# EAGLE schematic _nuc029LAN.06092f85-b559-42b7-8752-c31b1aa992a3 (EAGLE 9.7.0)

## Sheet 1 of 7: POWER
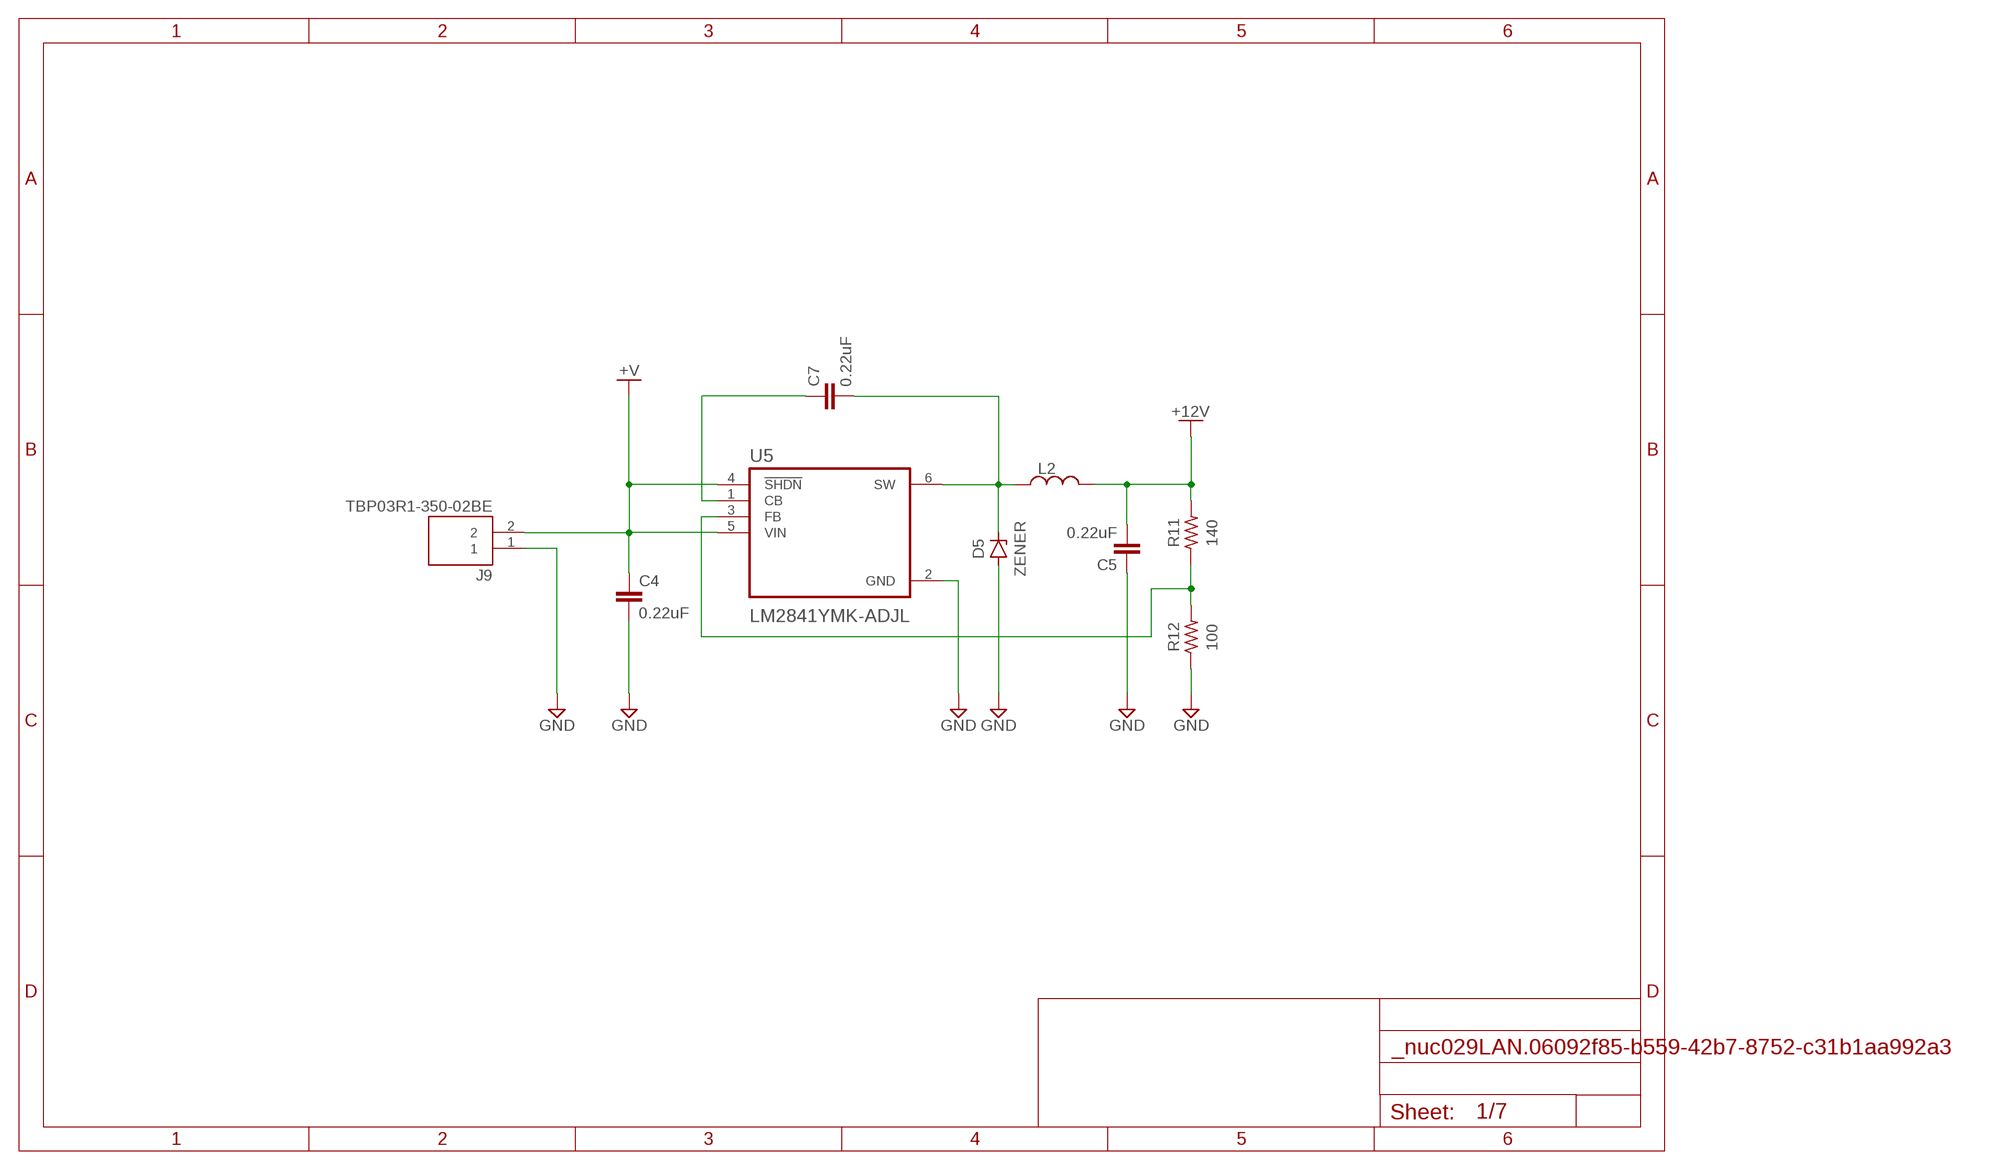
[diagram p0: schematic, sheet 1]

### Parts
C4  0.22uF  0.22UF-0603-50V-10%  [0603]
C5  0.22uF  0.22UF-0603-50V-10%  [0603]
C7  0.22uF  0.22UF-0603-50V-10%  [0603]
D5  ZENER  ZENERDO-214AB(SMC)  [DIOM7959X625N]
J9  TBP03R1-350-02BE  [CUI_TBP03R1-350-02BE]
L2  L_MOLDED(8530-METRIC)  [INDM8530X267]
R11  140  R-US_AXIAL-7.2MM-PITCH  [RESAD724W46L381D178B]
R12  100  R-US_AXIAL-7.2MM-PITCH  [RESAD724W46L381D178B]
U5  LM2841YMK-ADJL  [SOT95P280X110-6N]

### Nets
+12V: C5.2 L2.2 R11.2 ; also sheet 2,7
+V: C4.1 J9.2 U5.4(!SHDN) U5.5(VIN)
GND: C4.2 C5.1 D5.2(A) J9.1 R12.1 U5.2(GND) ; also sheet 2,3,6,7
N$15: C7.2 D5.1(C) L2.1 U5.6(SW)
N$19: C7.1 U5.1(CB)
N$21: R11.1 R12.2 U5.3(FB)

## Sheet 2 of 7
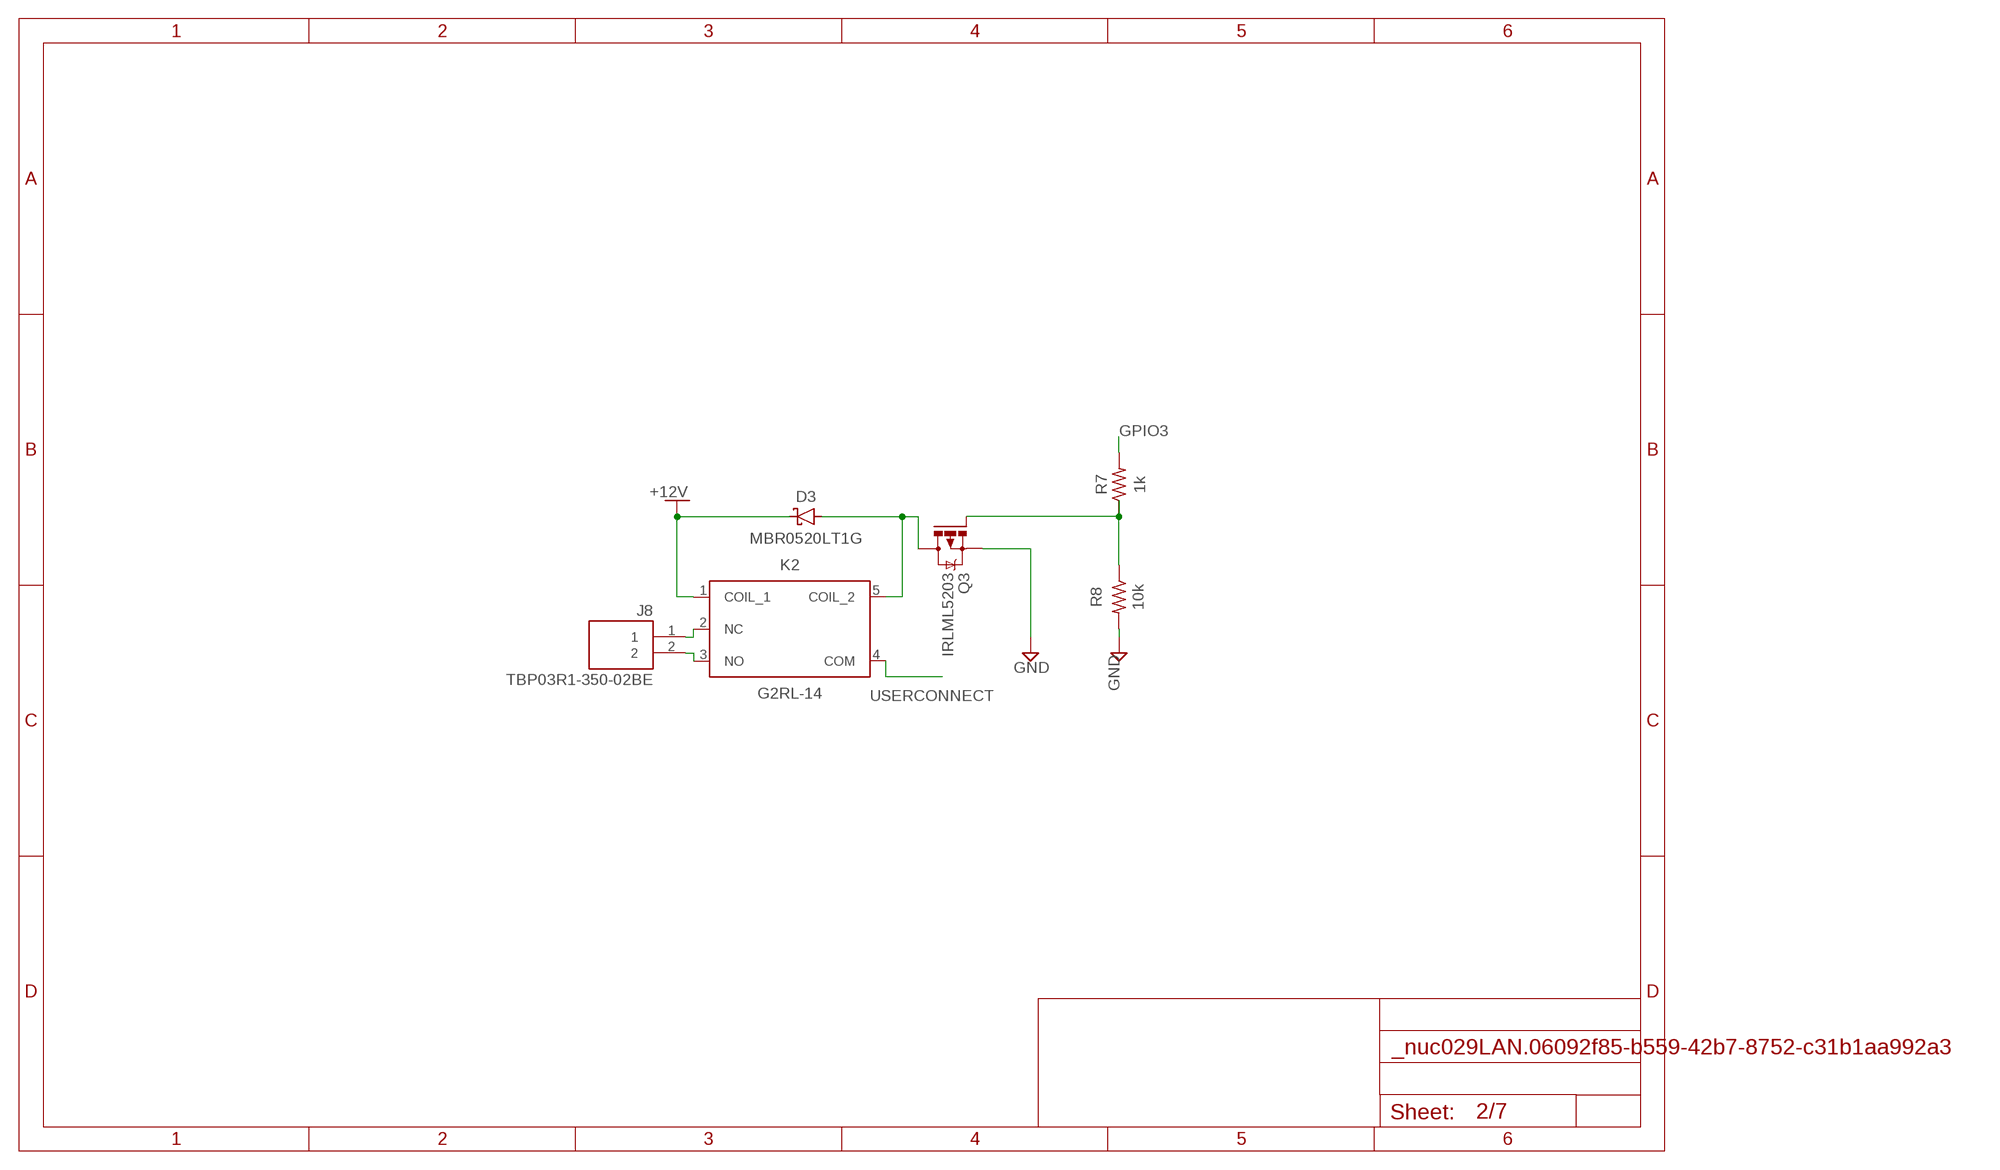
[diagram p1: schematic, sheet 2]

### Parts
D3  MBR0520LT1G  SCHOTTKY_MBR0520LT1GDO-219  [SODFL3718X115]
J8  TBP03R1-350-02BE  [CUI_TBP03R1-350-02BE]
K2  G2RL-14  [G2RL-1]
Q3  IRLML5203  PMOSFET_IRLML5203_SOT23-GSD  [SOT23]
R7  1k  R-US_AXIAL-7.2MM-PITCH  [RESAD724W46L381D178B]
R8  10k  R-US_AXIAL-7.2MM-PITCH  [RESAD724W46L381D178B]

### Nets
+12V: D3.1(C) K2.1(COIL_1) ; also sheet 1,7
GND: J8.1 K2.2(NC) Q3.2(S) R8.2 ; also sheet 1,3,6,7
GPIO3: R7.2 ; also sheet 6,7
N$9: J8.2 K2.3(NO)
N$20: Q3.1(G) R7.1 R8.1
USERCONNECT: K2.4(COM)
VOUT: D3.2(A) K2.5(COIL_2) Q3.3(D) ; also sheet 5,7

## Sheet 3 of 7
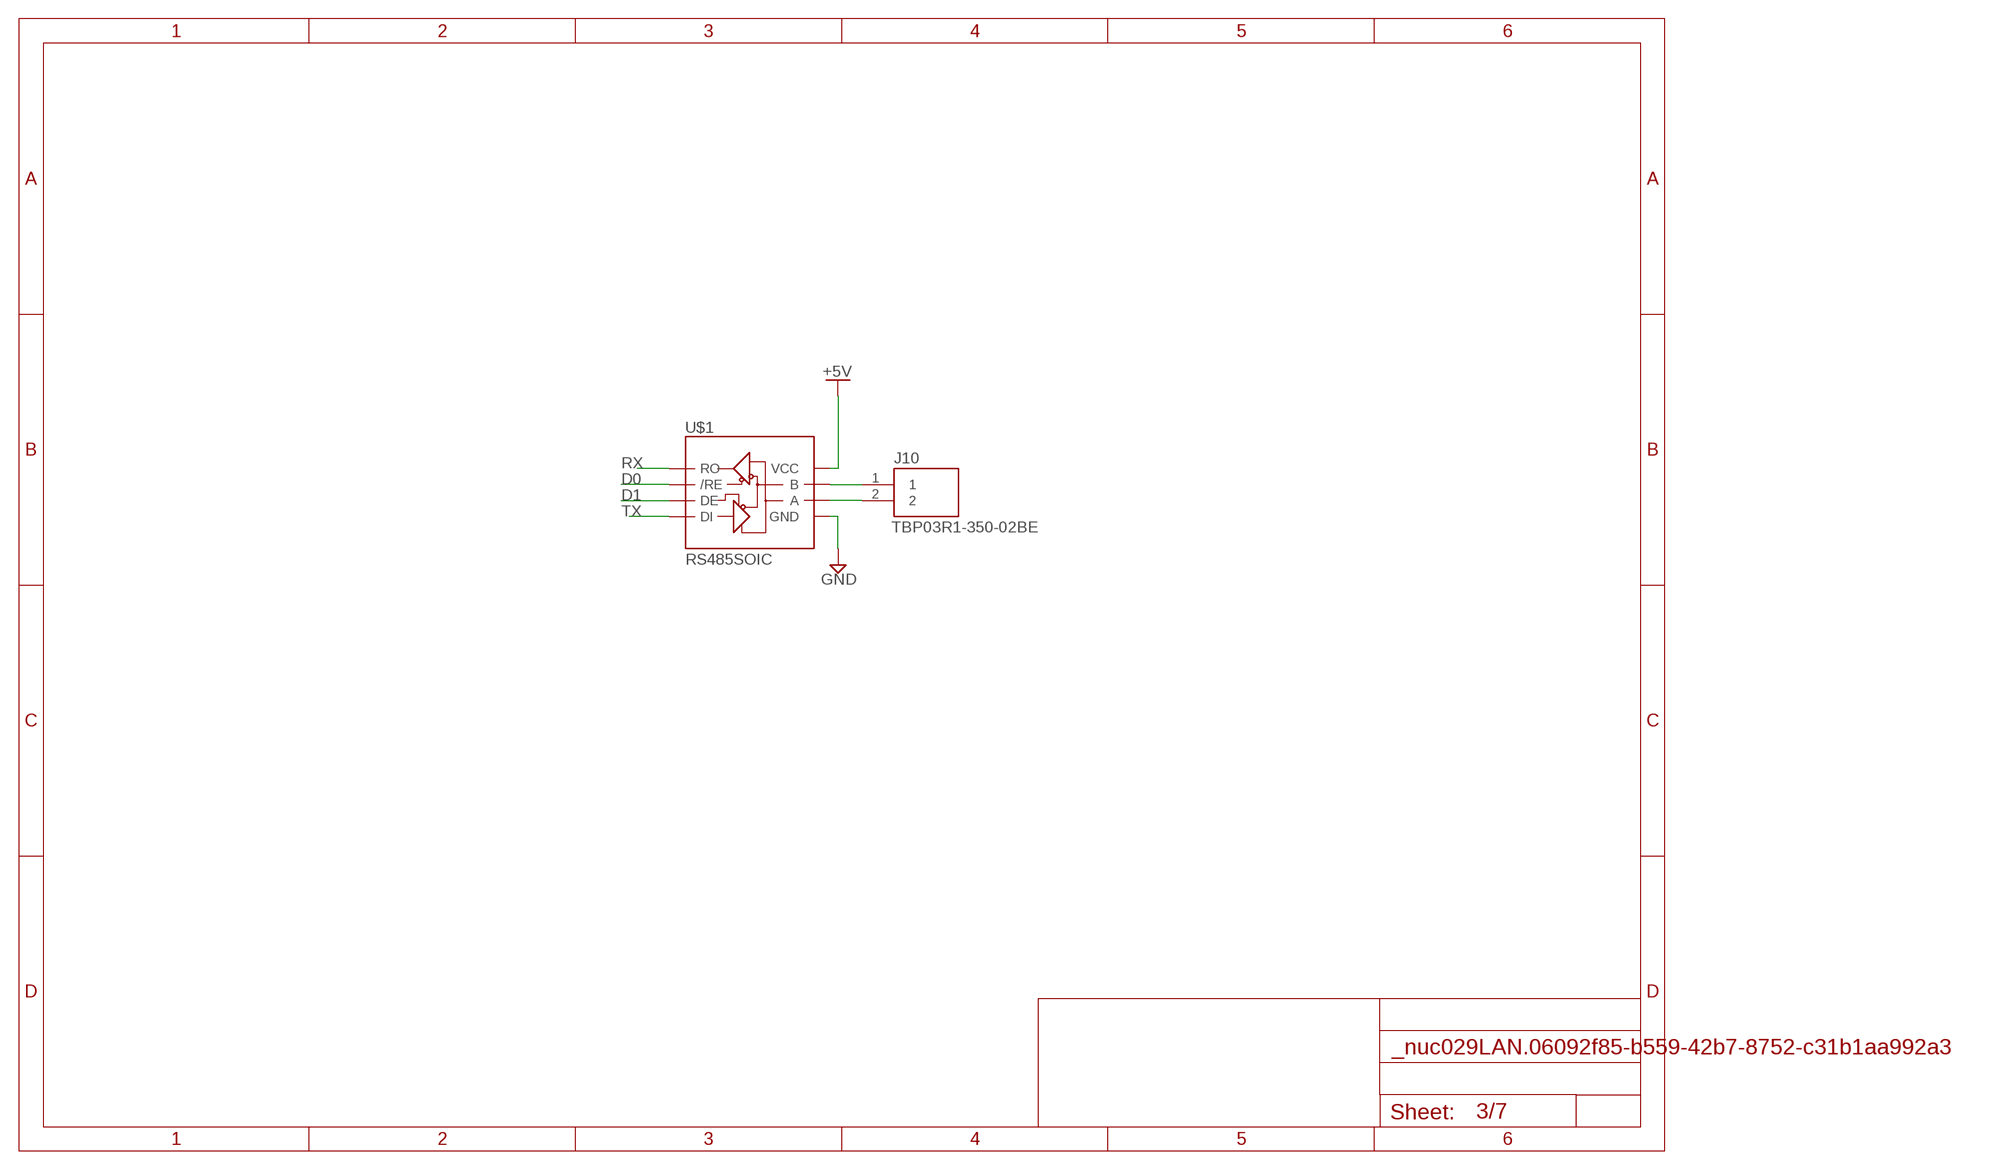
[diagram p2: schematic, sheet 3]

### Parts
J10  TBP03R1-350-02BE  [CUI_TBP03R1-350-02BE]
U$1  RS485SOIC  [SO08]

### Nets
+5V: U$1.8(VCC) ; also sheet 7
D0: U$1.2(/RE) ; also sheet 5,6,7
D1: U$1.3(DE) ; also sheet 5,6,7
GND: U$1.5(GND) ; also sheet 1,2,6,7
N$6: J10.1 U$1.7(B)
N$8: J10.2 U$1.6(A)
RX: U$1.1(RO) ; also sheet 6,7
TX: U$1.4(DI) ; also sheet 6,7

## Sheet 4 of 7
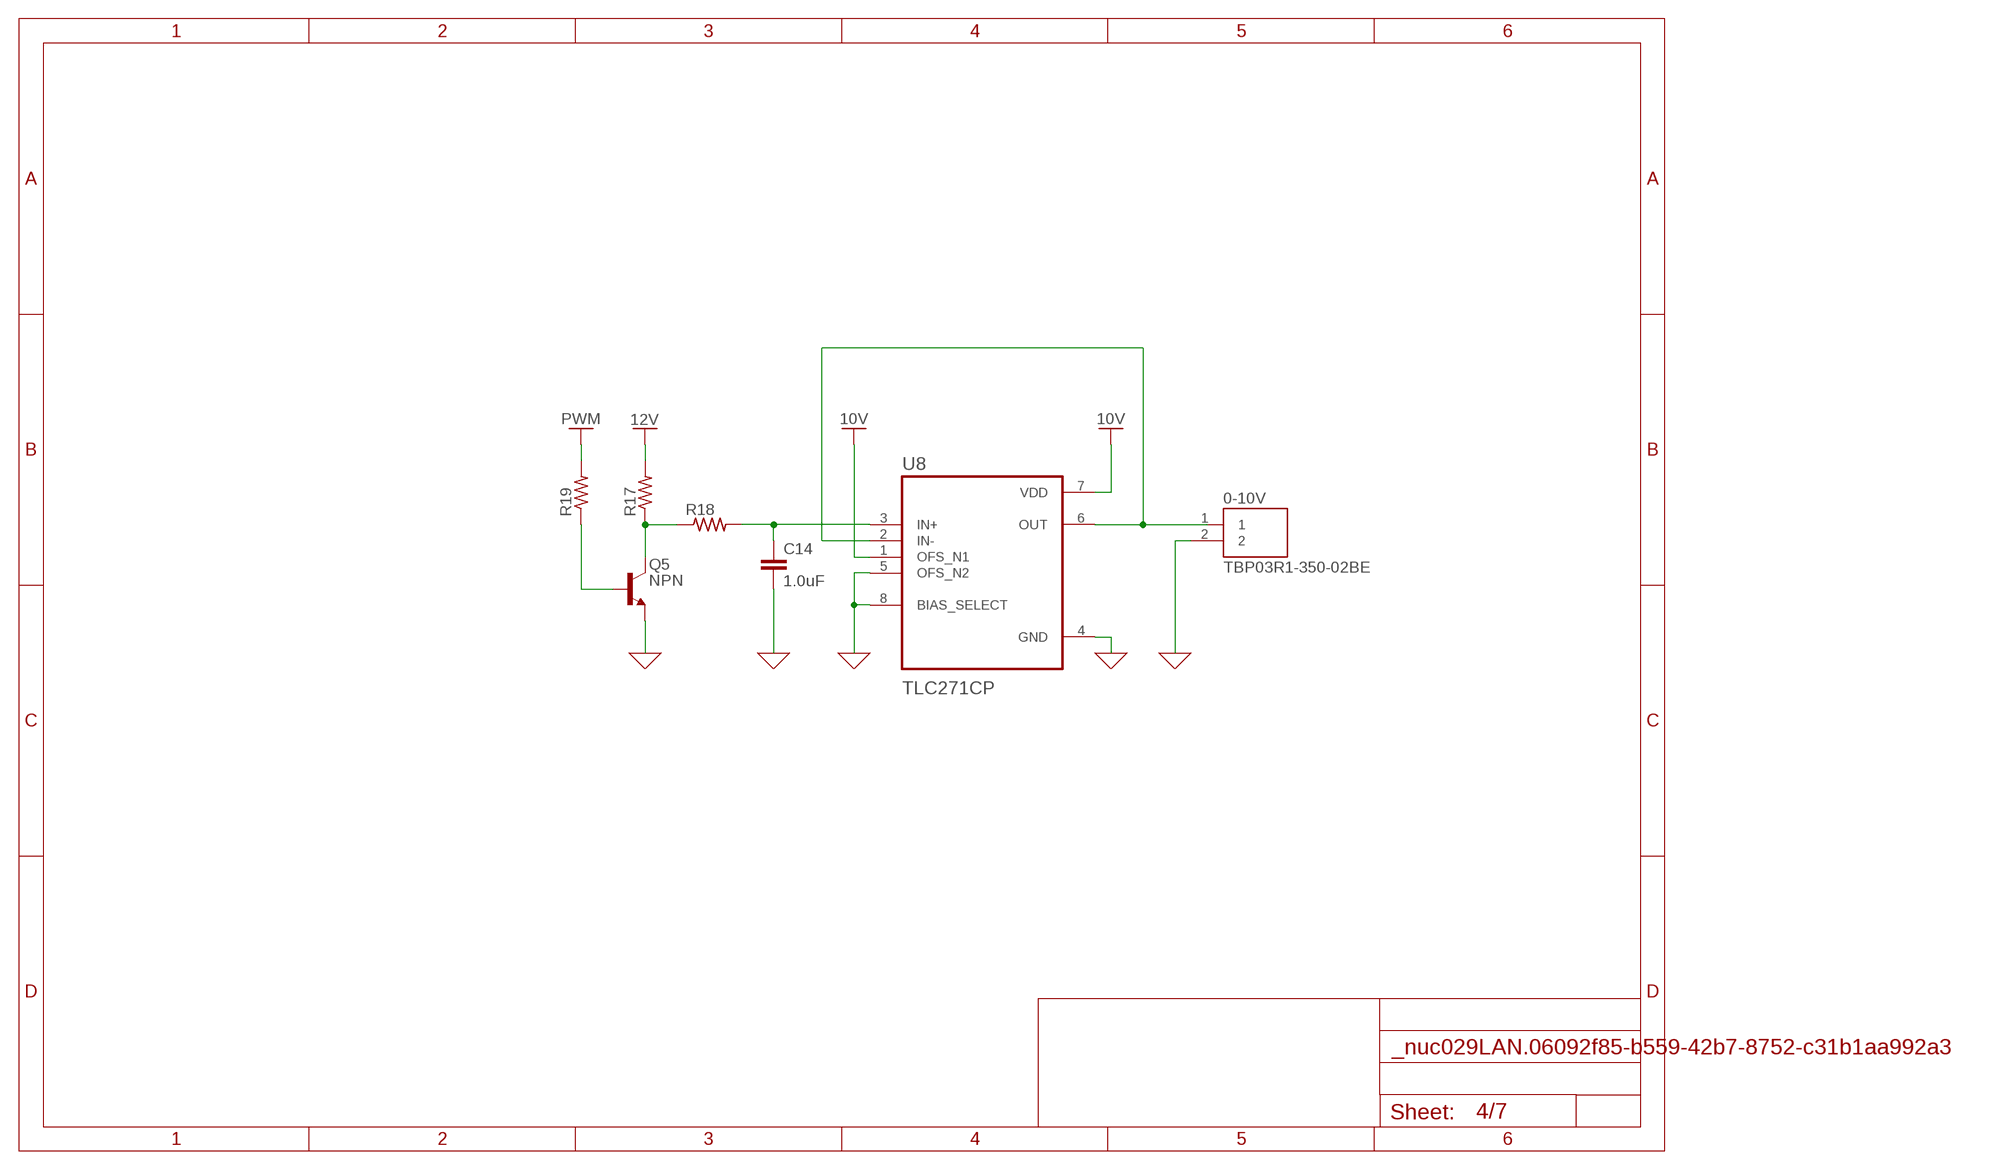
[diagram p3: schematic, sheet 4]

### Parts
0-10V  TBP03R1-350-02BE  [CUI_TBP03R1-350-02BE]
C14  1.0uF  1.0UF-0603-16V-10%-X7R-WE  [0603]
Q5  NPN  NPN_TO18-EBC  [TO18]
R17  R-US_CHIP-1210(3225-METRIC)  [RESC3224X71]
R18  R-US_CHIP-1210(3225-METRIC)  [RESC3224X71]
R19  R-US_CHIP-1210(3225-METRIC)  [RESC3224X71]
U8  TLC271CP  [DIP794W45P254L959H508Q8]

### Nets
0: 0-10V.2 C14.2 Q5.1(E) U8.4(GND) U8.5(OFS_N2) U8.8(BIAS_SELECT) ; supply symbol labelled GND
0-10V: 0-10V.1 U8.2(IN-) U8.6(OUT)
10V: U8.1(OFS_N1) U8.7(VDD) ; also sheet 6,7
12V: R17.2
N$25: Q5.3(C) R17.1 R18.1
N$26: Q5.2(B) R19.1
N$27: C14.1 R18.2 U8.3(IN+)
PWM: R19.2

## Sheet 5 of 7
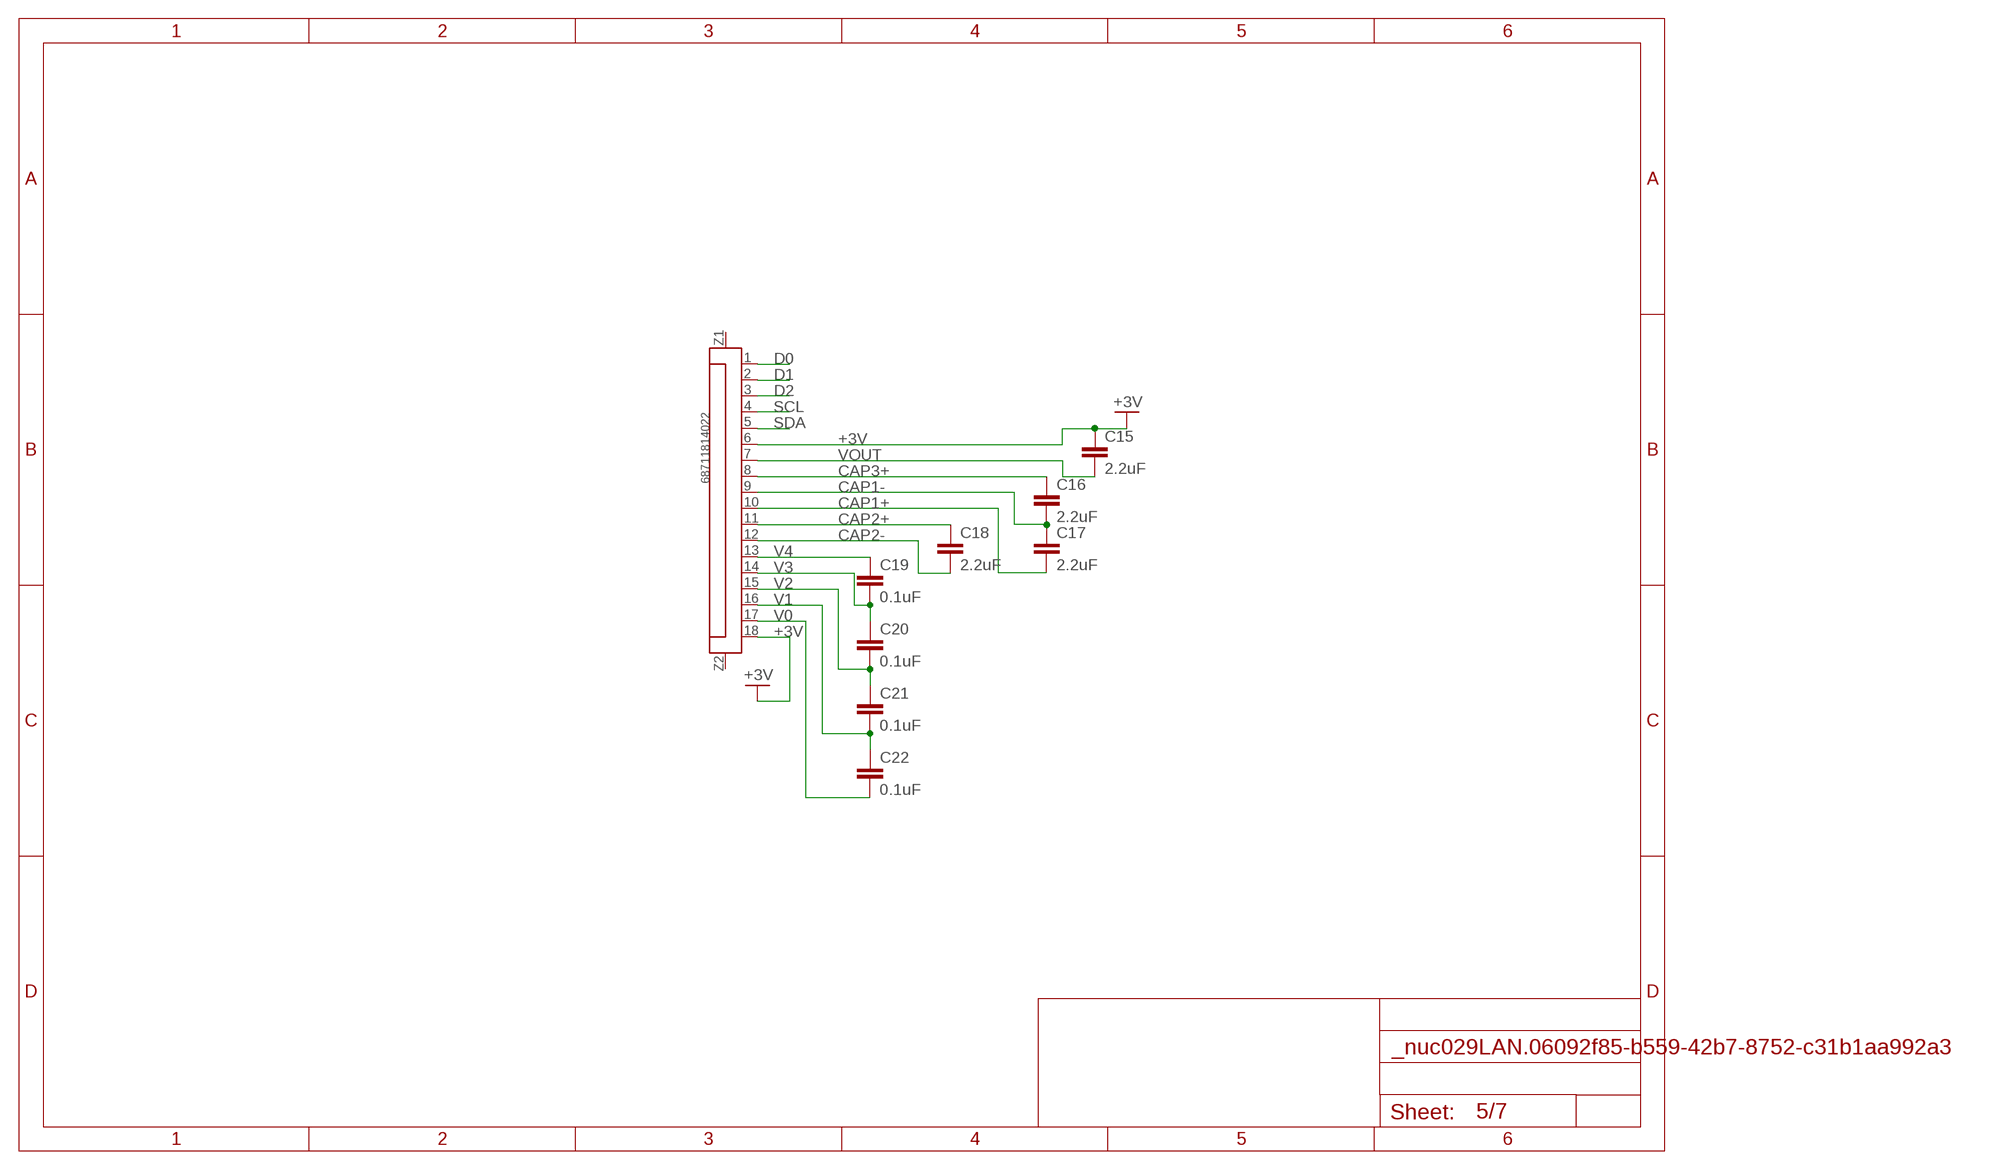
[diagram p4: schematic, sheet 5]

### Parts
/CS1  68711814022  6871XX14022_68711814022  [68711814022]
C15  2.2uF  2.2UF-0402_TIGHT-10V-10%-X5R  [0402-TIGHT]
C16  2.2uF  2.2UF-0402_TIGHT-10V-10%-X5R  [0402-TIGHT]
C17  2.2uF  2.2UF-0402_TIGHT-10V-10%-X5R  [0402-TIGHT]
C18  2.2uF  2.2UF-0402_TIGHT-10V-10%-X5R  [0402-TIGHT]
C19  0.1uF  0.1UF-0603-50V-10%-X7R-WE  [0603]
C20  0.1uF  0.1UF-0603-50V-10%-X7R-WE  [0603]
C21  0.1uF  0.1UF-0603-50V-10%-X7R-WE  [0603]
C22  0.1uF  0.1UF-0603-50V-10%-X7R-WE  [0603]

### Nets
+3V: /CS1.6 /CS1.18 C15.1
CAP1+: /CS1.10 C17.2
CAP1-: /CS1.9 C16.2 C17.1
CAP2+: /CS1.11 C18.1
CAP2-: /CS1.12 C18.2
CAP3+: /CS1.8 C16.1
D0: /CS1.1 ; also sheet 3,6,7
D1: /CS1.2 ; also sheet 3,6,7
D2: /CS1.3 ; also sheet 6,7
SCL: /CS1.4 ; also sheet 6,7
SDA: /CS1.5 ; also sheet 6,7
V0: /CS1.17 C22.2
V1: /CS1.16 C21.2 C22.1
V2: /CS1.15 C20.2 C21.1
V3: /CS1.14 C19.2 C20.1
V4: /CS1.13 C19.1
VOUT: /CS1.7 C15.2 ; also sheet 2,7
Unconnected: /CS1.Z1 /CS1.Z2

## Sheet 6 of 7
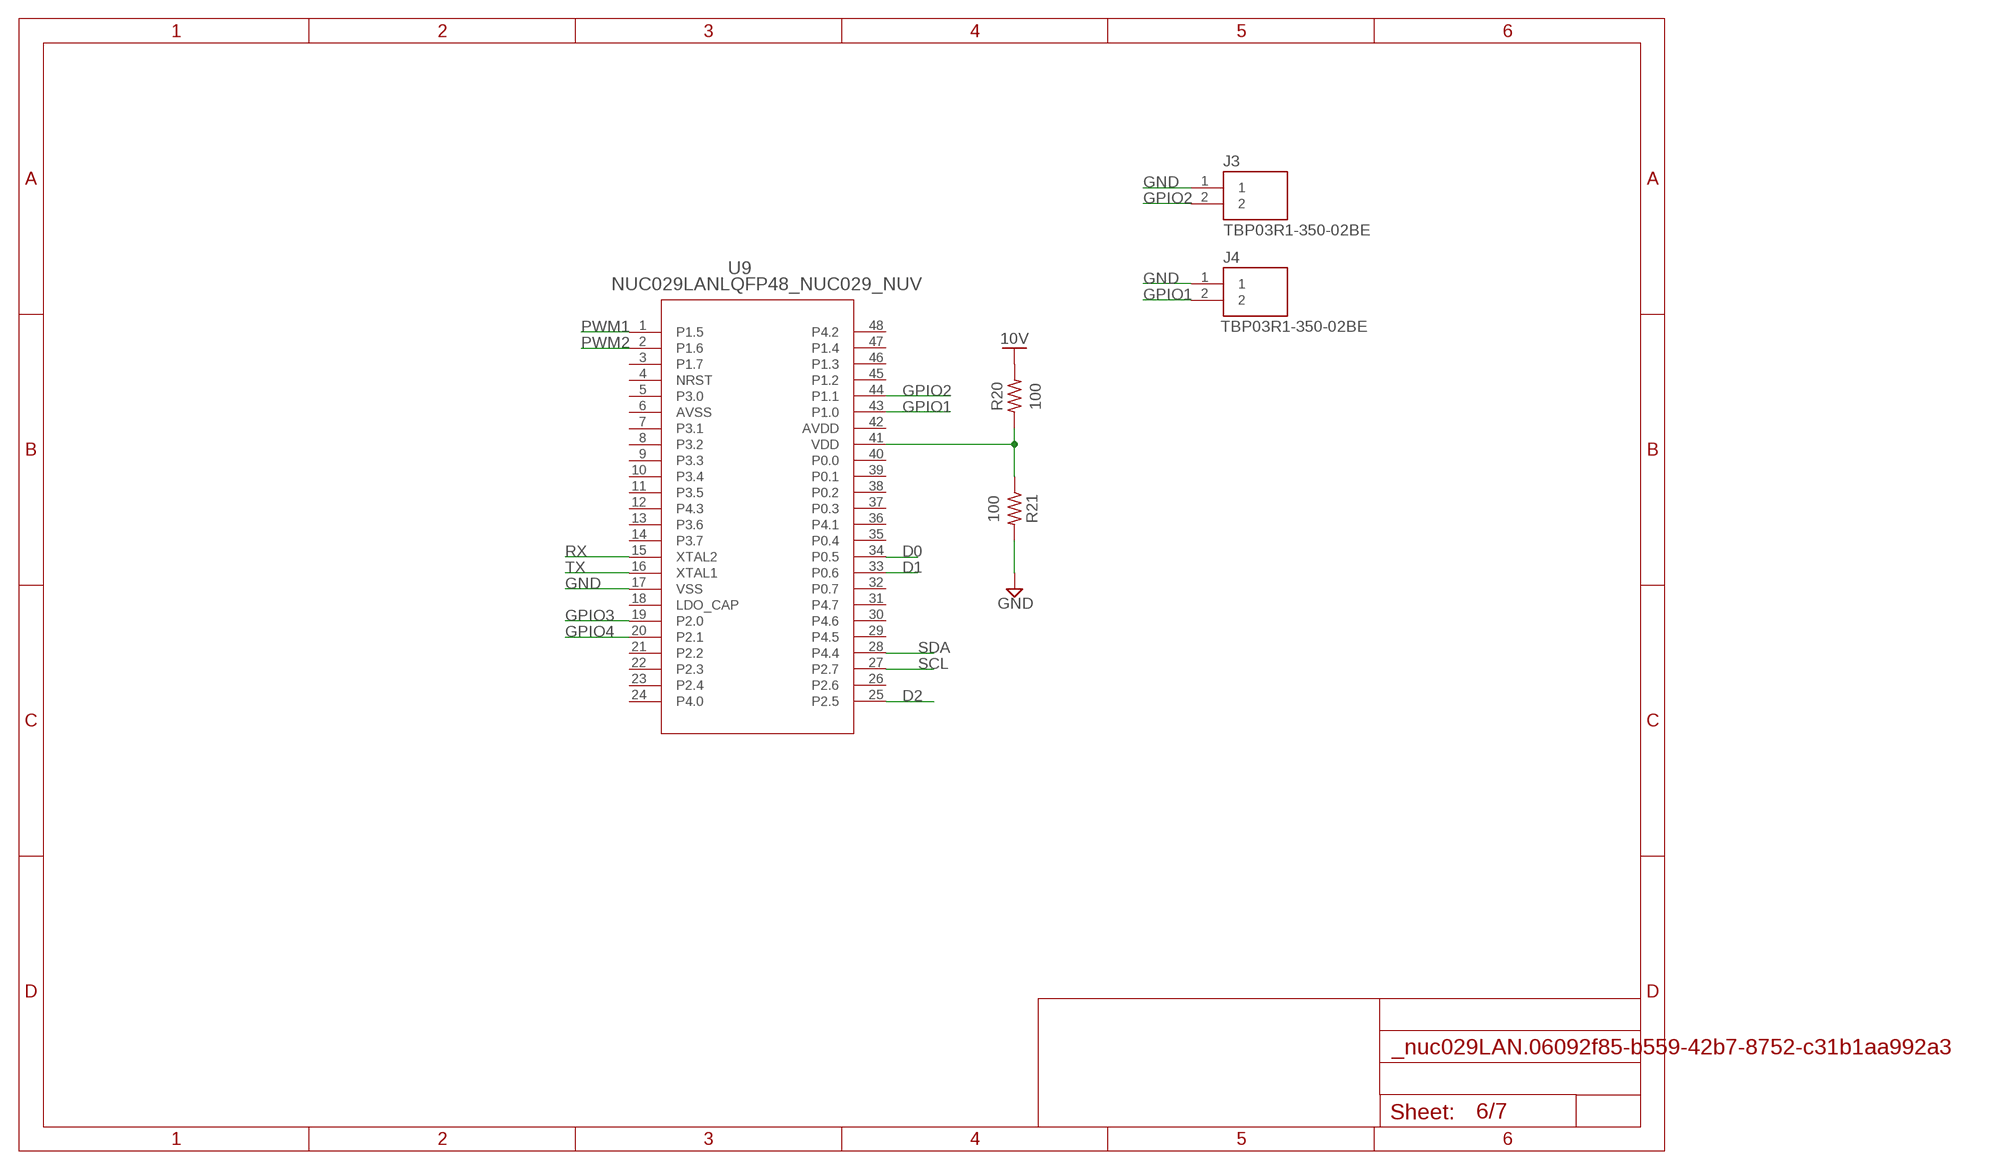
[diagram p5: schematic, sheet 6]

### Parts
J3  TBP03R1-350-02BE  [CUI_TBP03R1-350-02BE]
J4  TBP03R1-350-02BE  [CUI_TBP03R1-350-02BE]
R20  100  R-US_AXIAL-7.2MM-PITCH  [RESAD724W46L381D178B]
R21  100  R-US_AXIAL-7.2MM-PITCH  [RESAD724W46L381D178B]
U9  NUC029LANLQFP48_NUC029_NUV  [LQFP48_NUC029_NUV]

### Nets
10V: R20.2 ; also sheet 4,7
D0: U9.34(P0.5) ; also sheet 3,5,7
D1: U9.33(P0.6) ; also sheet 3,5,7
D2: U9.25(P2.5) ; also sheet 5,7
GND: J3.1 J4.1 R21.2 U9.17(VSS) ; also sheet 1,2,3,7
GPIO1: J4.2 U9.43(P1.0) ; also sheet 7
GPIO2: J3.2 U9.44(P1.1) ; also sheet 7
GPIO3: U9.19(P2.0) ; also sheet 2,7
GPIO4: U9.20(P2.1) ; also sheet 7
N$16: R20.1 R21.1 U9.41(VDD)
PWM1: U9.1(P1.5) ; also sheet 7
PWM2: U9.2(P1.6) ; also sheet 7
RX: U9.15(XTAL2) ; also sheet 3,7
SCL: U9.27(P2.7) ; also sheet 5,7
SDA: U9.28(P4.4) ; also sheet 5,7
TX: U9.16(XTAL1) ; also sheet 3,7
Unconnected: U9.3(P1.7) U9.4(NRST) U9.5(P3.0) U9.6(AVSS) U9.7(P3.1) U9.8(P3.2) U9.9(P3.3) U9.10(P3.4) U9.11(P3.5) U9.12(P4.3) U9.13(P3.6) U9.14(P3.7) U9.18(LDO_CAP) U9.21(P2.2) U9.22(P2.3) U9.23(P2.4) U9.24(P4.0) U9.26(P2.6) U9.29(P4.5) U9.30(P4.6) U9.31(P4.7) U9.32(P0.7) U9.35(P0.4) U9.36(P4.1) U9.37(P0.3) U9.38(P0.2) U9.39(P0.1) U9.40(P0.0) U9.45(P1.2) U9.46(P1.3) U9.47(P1.4) U9.48(P4.2)

## Sheet 7 of 7
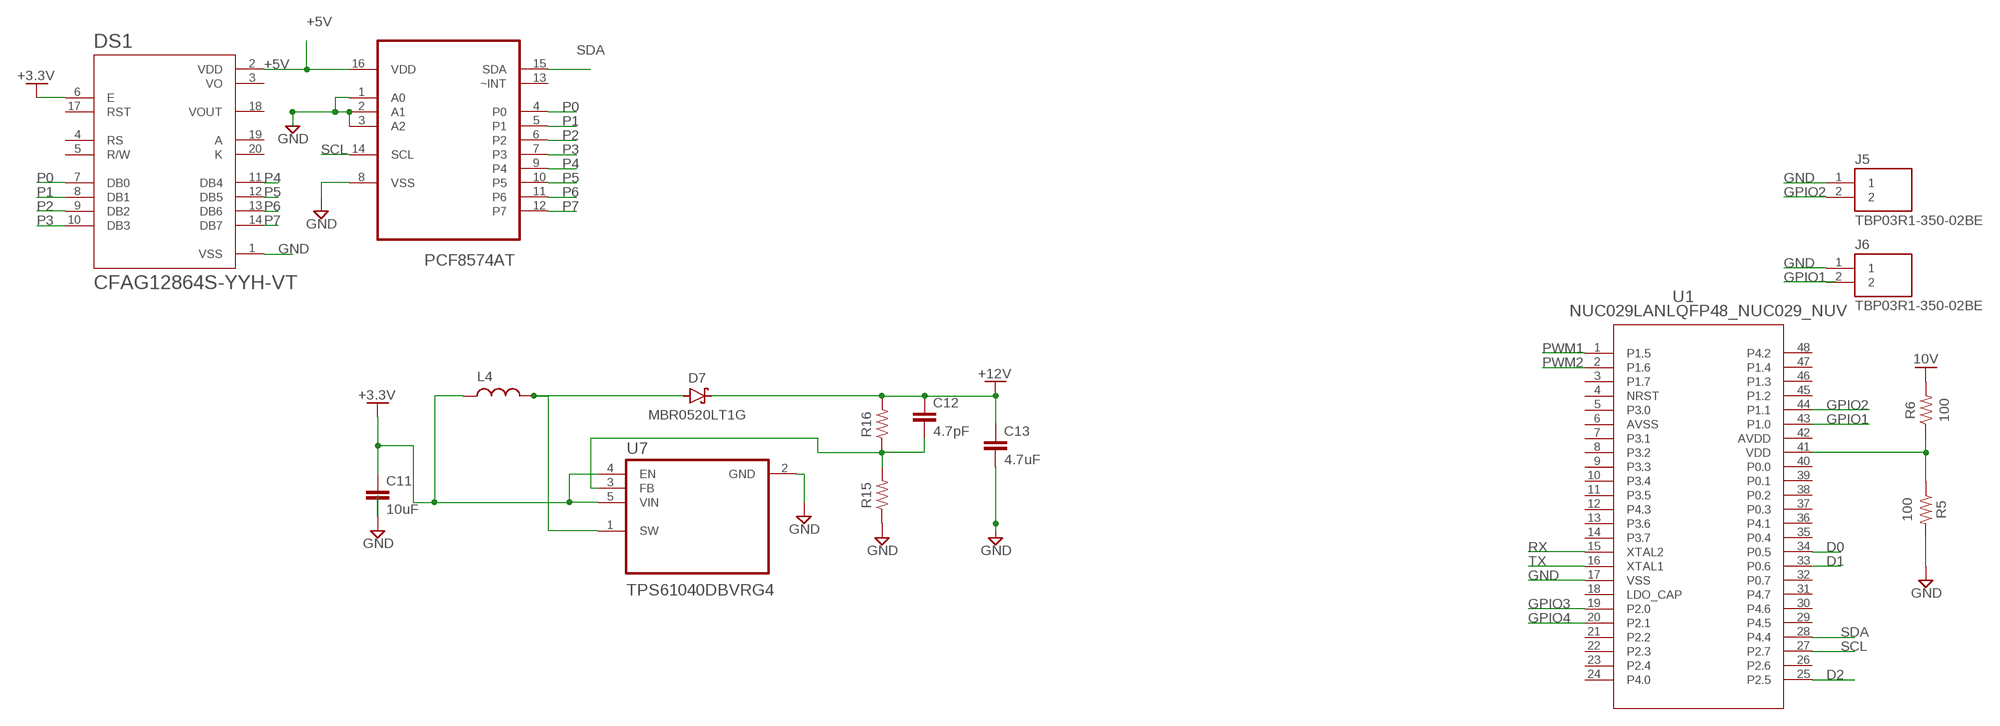
[diagram p6: schematic, sheet 7, part 1 of 2]
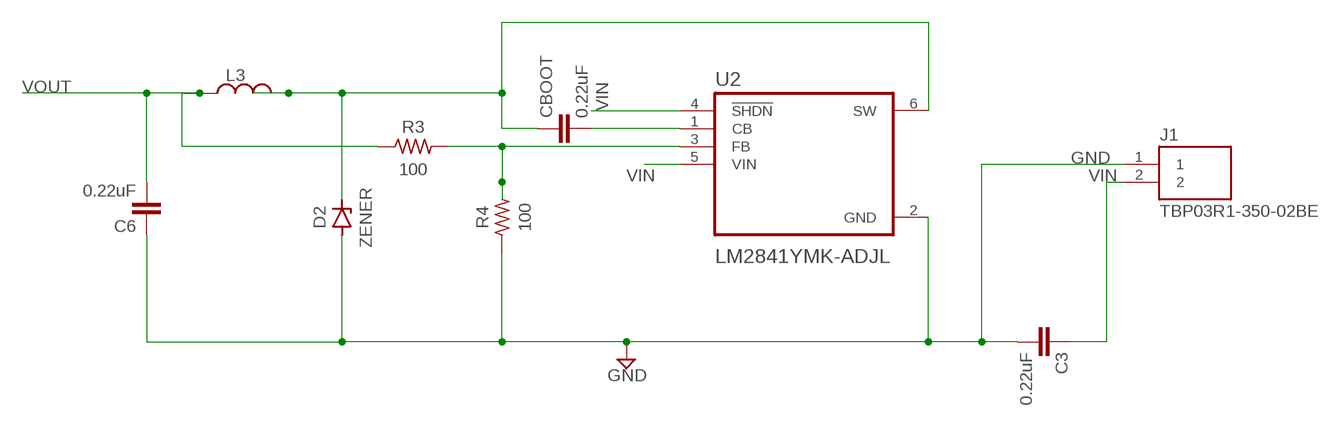
[diagram p7: schematic, sheet 7, part 2 of 2]

### Parts
C3  0.22uF  0.22UF-0603-50V-10%  [0603]
C6  0.22uF  0.22UF-0603-50V-10%  [0603]
C11  10uF  10UF-0402T-6.3V-20%  [0402-TIGHT]
C12  4.7pF  4.7PF-0603-50V-5%  [0603]
C13  4.7uF  4.7UF-0805-50V-(10%)  [0805]
CBOOT  0.22uF  0.22UF-0603-50V-10%  [0603]
D2  ZENER  ZENERDO-214AB(SMC)  [DIOM7959X625N]
D7  MBR0520LT1G  SCHOTTKY_MBR0520LT1GDO-219  [SODFL3718X115]
DS1  CFAG12864S-YYH-VT  [LCD_CFAG12864S-YYH-VT]
J1  TBP03R1-350-02BE  [CUI_TBP03R1-350-02BE]
J5  TBP03R1-350-02BE  [CUI_TBP03R1-350-02BE]
J6  TBP03R1-350-02BE  [CUI_TBP03R1-350-02BE]
L3  L_MOLDED(8530-METRIC)  [INDM8530X267]
L4  L  (no package)
R3  100  R-US_AXIAL-7.2MM-PITCH  [RESAD724W46L381D178B]
R4  100  R-US_AXIAL-7.2MM-PITCH  [RESAD724W46L381D178B]
R5  100  R-US_AXIAL-7.2MM-PITCH  [RESAD724W46L381D178B]
R6  100  R-US_AXIAL-7.2MM-PITCH  [RESAD724W46L381D178B]
R15  R-US_AXIAL-7.2MM-PITCH  [RESAD724W46L381D178B]
R16  R-US_AXIAL-7.2MM-PITCH  [RESAD724W46L381D178B]
U1  NUC029LANLQFP48_NUC029_NUV  [LQFP48_NUC029_NUV]
U2  LM2841YMK-ADJL  [SOT95P280X110-6N]
U4  PCF8574AT  [SOIC127P1032X265-16N]
U7  TPS61040DBVRG4  [SOT95P280X145-5N]

### Nets
10V: R6.2 ; also sheet 4,6
+3.3V: C11.1 DS1.6(E) L4.1 U7.4(EN) U7.5(VIN)
+5V: DS1.2(VDD) U4.16(VDD) ; also sheet 3
+12V: C12.1 C13.1 D7.1(C) R16.2 ; also sheet 1,2
D0: U1.34(P0.5) ; also sheet 3,5,6
D1: U1.33(P0.6) ; also sheet 3,5,6
D2: U1.25(P2.5) ; also sheet 5,6
GND: C3.2 C6.1 C11.2 C13.2 D2.2(A) DS1.1(VSS) J1.1 J5.1 J6.1 R4.1 R5.2 R15.1 U1.17(VSS) U2.2(GND) U4.1(A0) U4.2(A1) U4.3(A2) U4.8(VSS) U7.2(GND) ; also sheet 1,2,3,6
GPIO1: J6.2 U1.43(P1.0) ; also sheet 6
GPIO2: J5.2 U1.44(P1.1) ; also sheet 6
GPIO3: U1.19(P2.0) ; also sheet 2,6
GPIO4: U1.20(P2.1) ; also sheet 6
N$4: CBOOT.2 U2.1(CB)
N$5: CBOOT.1 D2.1(C) L3.2 U2.6(SW)
N$7: R3.2 R4.2 U2.3(FB)
N$12: R5.1 R6.1 U1.41(VDD)
N$18: C12.2 R15.2 R16.1 U7.3(FB)
N$24: D7.2(A) L4.2 U7.1(SW)
P0: DS1.7(DB0) U4.4(P0)
P1: DS1.8(DB1) U4.5(P1)
P2: DS1.9(DB2) U4.6(P2)
P3: DS1.10(DB3) U4.7(P3)
P4: DS1.11(DB4) U4.9(P4)
P5: DS1.12(DB5) U4.10(P5)
P6: DS1.13(DB6) U4.11(P6)
P7: DS1.14(DB7) U4.12(P7)
PWM1: U1.1(P1.5) ; also sheet 6
PWM2: U1.2(P1.6) ; also sheet 6
RX: U1.15(XTAL2) ; also sheet 3,6
SCL: U1.27(P2.7) U4.14(SCL) ; also sheet 5,6
SDA: U1.28(P4.4) U4.15(SDA) ; also sheet 5,6
TX: U1.16(XTAL1) ; also sheet 3,6
VIN: C3.1 J1.2 U2.4(!SHDN) U2.5(VIN)
VOUT: C6.2 L3.1 R3.1 ; also sheet 2,5
Unconnected: DS1.4(RS) DS1.5(R/W) DS1.17(RST) DS1.18(VOUT) DS1.19(A) DS1.20(K) U1.3(P1.7) U1.4(NRST) U1.5(P3.0) U1.6(AVSS) U1.7(P3.1) U1.8(P3.2) U1.9(P3.3) U1.10(P3.4) U1.11(P3.5) U1.12(P4.3) U1.13(P3.6) U1.14(P3.7) U1.18(LDO_CAP) U1.21(P2.2) U1.22(P2.3) U1.23(P2.4) U1.24(P4.0) U1.26(P2.6) U1.29(P4.5) U1.30(P4.6) U1.31(P4.7) U1.32(P0.7) U1.35(P0.4) U1.36(P4.1) U1.37(P0.3) U1.38(P0.2) U1.39(P0.1) U1.40(P0.0) U1.45(P1.2) U1.46(P1.3) U1.47(P1.4) U1.48(P4.2) U4.13(~INT)

## Power pins joined to a net without a drawn wire
AVDD: U1.42(AVDD) U9.42(AVDD)
VO: DS1.3(VO)

## Library data of the parts
0-10V J1 J3-J6 J8-J10 = TBP03R1-350-02BE:TBP03R1-350-02BE: Check availability <https://pricing.snapeda.com/parts/TBP03R1-350-02BE/CUI%20Devices/view-part?ref=eda>; AVAILABILITY: In Stock; CHECK_PRICES: https://www.snapeda.com/parts/TBP03R1-350-02BE/CUI+Devices/view-part/?ref=eda; CUI_PURCHASE_URL: https://www.cuidevices.com/product/interconnect/connectors/terminal-blocks/tbp03r1-350-series?utm_source=snapeda.com&utm_medium=referral&utm_campaign=snapedaBOM; DESCRIPTION: 2~24 Poles, Pluggable, Receptacle, Horizontal, 3.50 Pitch, Terminal Block Connector; MF: CUI Devices; MP: TBP03R1-350-02BE; PACKAGE: None; PRICE: None; PURCHASE-URL: https://www.snapeda.com/api/url_track_click_mouser/?unipart_id=9135446&manufacturer=CUI Devices&part_name=TBP03R1-350-02BE&search_term=terminal blocks; SNAPEDA_LINK: https://www.snapeda.com/parts/TBP03R1-350-02BE/CUI+Devices/view-part/?ref=snap
/CS1 = Wurth_Connectors_WR-FPC:6871XX14022_68711814022: WR-FPC 0.50 mm SMT ZIF Horizontal Top Contact KIND PROPERTIES Pitch 0.5 mm MATERIAL PROPERTIES Insulator Material LCP Contact Material Phosphor Bronze Contact Plating 100 (µ") Tin over 50 (µ") Nickel Contact Type Stamped Solder Tabs Brass <https://www.we-online.com/catalog/media/o32866v209%20Family_WE-FPC_6871xx14022.jpg> Details see: https://www.we-online.com/catalog/en/FPC_0_5_SMT_ZIF_HORIZONTAL_TOP_CONTACT_6871XX14022/ Updated by Ella Wu 2020-08-26 2020(C) Wurth Elektronik; CONTACT-RESISTANCE: 20mOhm; DATASHEET-URL: https://www.we-online.com/catalog/datasheet/68711814022.pdf; IR: 0.5A; L: 15.4mm; PACKAGING: Tape and Reel; PART-NUMBER: 68711814022; PINS: 18; PITCH: 0.5mm; TYPE: Horizontal; WORKING-VOLTAGE: 50V(AC)
C3-C7 CBOOT = SparkFun-Capacitors:0.22UF: 0.22µF ceramic capacitors A capacitor is a passive two-terminal electrical component used to store electrical energy temporarily in an electric field.; PROD_ID: CAP-15456
C11 = SparkFun-Capacitors:10UF: 10.0µF ceramic capacitors A capacitor is a passive two-terminal electrical component used to store electrical energy temporarily in an electric field.; PROD_ID: CAP-14848
C12 = SparkFun-Capacitors:4.7PF: 4.7pF ceramic capacitors A capacitor is a passive two-terminal electrical component used to store electrical energy temporarily in an electric field.; PROD_ID: CAP-07880
C13 = SparkFun-Capacitors:4.7UF: 4.7µF ceramic capacitors A capacitor is a passive two-terminal electrical component used to store electrical energy temporarily in an electric field.; PROD_ID: CAP-15457
C14 = SparkFun-Capacitors:1.0UF: 1µF ceramic capacitors A capacitor is a passive two-terminal electrical component used to store electrical energy temporarily in an electric field.; PROD_ID: CAP-16504
C15-C18 = SparkFun-Capacitors:2.2UF: 2.2µF ceramic capacitors A capacitor is a passive two-terminal electrical component used to store electrical energy temporarily in an electric field.; PROD_ID: CAP-14232
C19-C22 = SparkFun-Capacitors:0.1UF: 0.1µF ceramic capacitors A capacitor is a passive two-terminal electrical component used to store electrical energy temporarily in an electric field.; PROD_ID: CAP-16523
D2 D5 = Diode:ZENER: Zener Diode - Generic; CATEGORY: Diode; SUB-CATEGORY: Zener
D3 D7 = Diode:SCHOTTKY_: Schottky Diode - Popular parts; CATEGORY: Diode; DESCRIPTION: DIODE SCHOTTKY 20V 500MA SOD123; MANUFACTURER: ON Semiconductor; MPN: MBR0520LT1G; SUB-CATEGORY: Schottky
DS1 = CFAG12864S-YYH-VT:CFAG12864S-YYH-VT: Sunlight Readable 128x64 Graphic LCD with positive voltage generator Check availability <https://pricing.snapeda.com/parts/CFAG12864S-YYH-VT/Crystalfontz/view-part?ref=eda>; AVAILABILITY: Not in stock; CHECK_PRICES: https://www.snapeda.com/parts/CFAG12864S-YYH-VT/Crystalfontz/view-part/?ref=eda; DESCRIPTION: Sunlight Readable 128x64 Graphic LCD with positive voltage generator; MF: Crystalfontz; MP: CFAG12864S-YYH-VT; PACKAGE: Package; PRICE: None; SNAPEDA_LINK: https://www.snapeda.com/parts/CFAG12864S-YYH-VT/Crystalfontz/view-part/?ref=snap
K2 = Relay:G2RL-1: CONTACT TYPE : SPDT COIL RATING : 5 to 48 VDC Datasheet <https://omronfs.omron.com/en_US/ecb/products/pdf/en-g2rl.pdf>; CATEGORY: RELAY; MANUFACTURER: OMRON; OPERATING_TEMP: -40°C to 85°C; PART_STATUS: ACTIVE; ROHS_COMPLIANCE: ROHS COMPLIANT; SERIES: G2RL; SUB-CATEGORY: Power Relay; TYPE: SPDT
L2 L3 = Inductor:L: Inductor Fixed - Generic; CATEGORY: Inductor; SUB-CATEGORY: Fixed
L4 = ngspice-simulation:L: INDUCTOR
Q3 = Transistor:PMOSFET_: P-Channel MOSFET - Popular parts; CATEGORY: Transistor; DESCRIPTION: MOSFET P-CH 30V 3A SOT-23; DRAIN_CURRENT: 3A; MANUFACTURER: Infineon Technologies; MPN: IRLML5203TRPBF; OPERATING_TEMP: -55°C ~ 150°C; PART_STATUS: Active; ROHS_COMPLIANT: Yes; SUB-CATEGORY: MOSFET; THERMALLOSS: 1.25W; TYPE: P-Channel
Q5 = Transistor:NPN: NPN - Generic; CATEGORY: Transistor; SUB-CATEGORY: BJT; TYPE: NPN
R3-R8 R11 R12 R15 R16 R20 R21 = Resistor:R-US: Resistor Fixed - ANSI; CATEGORY: Resistor; SUB-CATEGORY: Fixed
R17-R19 = Tutorial - Fusion 360:R-US: Resistor Fixed - ANSI
U1 U9 = 2024-06-24_08-59-36_Library:NUC029LAN; COPYRIGHT: Copyright (C) 2024 Ultra Librarian. All rights reserved.; MANUFACTURER_PART_NUMBER: NUC029LAN; MFR_NAME: Nuvoton
U2 U5 = LM2841YMK-ADJL:LM2841YMK-ADJL: Check availability <https://pricing.snapeda.com/parts/LM2841YMK-ADJL/NOPB/Texas%20Instruments/view-part?ref=eda>; AVAILABILITY: In Stock; CHECK_PRICES: https://www.snapeda.com/parts/LM2841YMK-ADJL/NOPB/Texas+Instruments/view-part/?ref=eda; DESCRIPTION: 4.5V to 42V, 300mA SIMPLE SWITCHER® buck converter in thin SOT-23; MF: Texas Instruments; MP: LM2841YMK-ADJL/NOPB; PACKAGE: SOT-23-THN-6 Texas Instruments; PRICE: None; PURCHASE-URL: https://www.snapeda.com/api/url_track_click_mouser/?unipart_id=25681&manufacturer=Texas Instruments&part_name=LM2841YMK-ADJL/NOPB&search_term=buck converter; SNAPEDA_LINK: https://www.snapeda.com/parts/LM2841YMK-ADJL/NOPB/Texas+Instruments/view-part/?ref=snap
U4 = PCF8574AT:PCF8574AT: Remote 8-bit I/O expander for I2C-bus Check availability <https://pricing.snapeda.com/parts/PCF8574AT/NXP%20Semiconductors/view-part?ref=eda>; AVAILABILITY: In Stock; CHECK_PRICES: https://www.snapeda.com/parts/PCF8574AT/NXP+Semiconductors/view-part/?ref=eda; DESCRIPTION: I/O Expander 8 I²C 100kHz 20-SSOP; MF: NXP Semiconductors; MP: PCF8574AT; PACKAGE: SSOP-20 NXP Semiconductors; PRICE: None; PURCHASE-URL: https://www.snapeda.com/api/url_track_click_mouser/?unipart_id=4480931&manufacturer=NXP Semiconductors&part_name=PCF8574AT&search_term=pcf8574a; SNAPEDA_LINK: https://www.snapeda.com/parts/PCF8574AT/NXP+Semiconductors/view-part/?ref=snap
U7 = TPS61040DBVRG4:TPS61040DBVRG4: Check availability <https://pricing.snapeda.com/parts/TPS61040DBVRG4/Texas%20Instruments/view-part?ref=eda>; AVAILABILITY: In Stock; CHECK_PRICES: https://www.snapeda.com/parts/TPS61040DBVRG4/Texas+Instruments/view-part/?ref=eda; DESCRIPTION: 28-V, 400-mA Switch Boost Converter in SOT-23 for LCD and White LED Applications 5-SOT-23 -40 to 85; MF: Texas Instruments; MP: TPS61040DBVRG4; PACKAGE: SOT-23-5 Texas Instruments; PRICE: None; PURCHASE-URL: https://www.snapeda.com/api/url_track_click_mouser/?unipart_id=479445&manufacturer=Texas Instruments&part_name=TPS61040DBVRG4&search_term= tps6104; SNAPEDA_LINK: https://www.snapeda.com/parts/TPS61040DBVRG4/Texas+Instruments/view-part/?ref=snap
U8 = TLC271CP:TLC271CP; CHECK_PRICES: https://www.snapeda.com/parts/TLC271CP/Texas+Instruments/view-part/?ref=eda; DESCRIPTION: Single, 16-V, 2-MHz, In to V- operational amplifier; MF: Texas Instruments; MP: TLC271CP; PACKAGE: PDIP-8 Texas; RS_COMPONENTS_1450393_PURCHASE_URL: https://www.snapeda.com/api/url_track_click/https%253A//uk.rs-online.com/web/p/op-amps/1450393//%253Futm_campaign%253Dbuynow%2526utm_medium%253Daggregator%2526utm_source%253Dsnapeda%2526cm_mmc%253Daff-_-uk-_-snapeda-_-1450393/?unipart_id=428174&manufacturer=Texas Instruments&part_name=TLC271CP&search_term=tlc271; RS_COMPONENTS_638914P_PURCHASE_URL: https://www.snapeda.com/api/url_track_click/https%253A//uk.rs-online.com/web/p/op-amps/0638914p//%253Futm_campaign%253Dbuynow%2526utm_medium%253Daggregator%2526utm_source%253Dsnapeda%2526cm_mmc%253Daff-_-uk-_-snapeda-_-638914P/?unipart_id=428174&manufacturer=Texas Instruments&part_name=TLC271CP&search_term=tlc271; RS_COMPONENTS_638914_PURCHASE_URL: https://www.snapeda.com/api/url_track_click/https%253A//uk.rs-online.com/web/p/op-amps/0638914//%253Futm_campaign%253Dbuynow%2526utm_medium%253Daggregator%2526utm_source%253Dsnapeda%2526cm_mmc%253Daff-_-uk-_-snapeda-_-638914/?unipart_id=428174&manufacturer=Texas Instruments&part_name=TLC271CP&search_term=tlc271; SNAPEDA_LINK: https://www.snapeda.com/parts/TLC271CP/Texas+Instruments/view-part/?ref=snap
U$1 = RS485:RS485: RS485 transceiver Check availability <https://pricing.snapeda.com/parts/RS485/Littelfuse/view-part?ref=eda>; AVAILABILITY: Not in stock; CHECK_PRICES: https://www.snapeda.com/parts/RS485/Littelfuse/view-part/?ref=eda; DESCRIPTION: Convenient and Cost Effective Two Wire Modbus; MF: Littelfuse; MP: RS485; PACKAGE: None; PRICE: None; PURCHASE-URL: https://www.snapeda.com/api/url_track_click_mouser/?unipart_id=6622752&manufacturer=Littelfuse&part_name=RS485&search_term=rs485; SNAPEDA_LINK: https://www.snapeda.com/parts/RS485/Littelfuse/view-part/?ref=snap